# Altium project project_thermal.PrjPcb
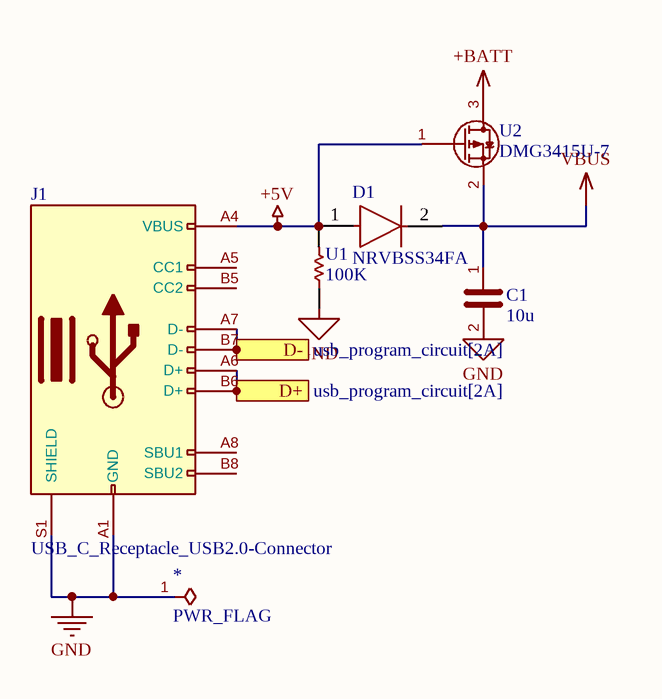
[diagram p0: USB_input_and_Power.SchDoc]
13 sheets, 58 parts. Net scope: flat (ports and power ports of the same name join across sheets).
Board file: Thermal_PCB.PcbDoc
Sheets:
  USB_input_and_Power.SchDoc
  3.3V_Regulator.SchDoc
  On_Off_switch.SchDoc
  batterij_charging.SchDoc
  batterij_voltage_sensor.SchDoc
  tft_display.SchDoc
  backlight_control.SchDoc
  usb_program_circuit.SchDoc
  esp32.SchDoc
  imagesensor.SchDoc
  ecternal_i2c.SchDoc
  navigatie_switches.SchDoc
  sd_card.SchDoc

## Sheet USB_input_and_Power.SchDoc
size A4; SheetNumber: 1; SheetTotal: 13

### Parts
(Parts that share a designator on the sheet are numbered #1, #2 ... from top to bottom, then left to right.)
*#1  PWR_FLAG  (graphical)
C1  10u  [CAPC2013X70X45NL10T25]
D1  NRVBSS34FA  [NRVBSS34FA]
J1  USB_C_Receptacle_USB2.0-Connector  [Type C USB Connector]
U1  100K  [RESC2013X70X40NL20T20]
U2  DMG3415U-7  [DMG3415U-7]

### Ports
D+ (see usb_program_circuit[2A]), D- (see usb_program_circuit[2A])

### Nets
+5V: D1.1 J1.A4(VBUS) U1.2 U2.1(G)
+BATT: U2.3(D)
GND: *#1.1(pwr) C1.2 J1.A1(GND) J1.S1(SHIELD) U1.1
VBUS: C1.1 D1.2 U2.2(S)
NetJ1_A6: J1.A6(D+) J1.B6(D+) ; port D+
NetJ1_A7: J1.A7(D-) J1.B7(D-) ; port D-

Not connected (* = marked no-connect by the designer): J1 A5(CC1) A8(SBU1) A9(VBUS) A12(GND) B1(GND) B4(VBUS) B5(CC2) B8(SBU2) B9(VBUS) B12(GND)

### Library data of the parts
C1 = C
D1 = CMP-00278-103808874-1: NRVBSS34FA Schottky Barrier Rectifier Diode 40V 3A 2-Pin SOD−123FL T/R; Manufacturer Lifecycle Status: ACTIVE; Max Junction Temperature (Tj): 125°C; Capacitance: 152pF; Peak Reverse Current: 500µA; Max Forward Surge Current (Ifsm): 80A; RoHS: Compliant; Forward Current: 3A; Height: 1.43mm; Max Operating Temperature: 125°C; Min Operating Temperature: -55°C; Lifecycle Status: Production; Max Repetitive Reverse Voltage (Vrrm): 40V; Reverse Voltage: 40V; NexarPartId: 103808874
U1 = CMP-2100-03671-1: Chip Resistor, 1 KOhm, +/- 1%, 125 mW, -55 to 155 degC, 0805 (2012 Metric), RoHS, Tape and Reel; Manufacturer: Yageo; Temperature Coefficient: 100ppm/degreesC; Voltage Rating (DC): 150V; Max Power Dissipation: 125mW; Resistance: 1KOhm; Number of Pins: 2; Number of Terminations: 2; Datasheet URL: http://www.yageo.com/NewPortal/yageodocoutput?fileName=/pdf/R-Chip/PYu-RC_Group_51_RoHS_L_5.pdf; Length: 0.079inch; Package Description: 2-Pin Surface Mounted Device, Body 2 x 1.25 mm; Depth: 1.25mm; Height: 0.024inch; Military Standard: Not; Case/Package: 0805; Package Reference: 0805; RoHSCompliant: true; Lead Free: LeadFree; Packaging: TapeandReel; Package Quantity: 1; Datasheet Version: Rev. 5, 10/2016; Tolerance: 1%; Min Operating Temperature: -55degC; Voltage Rating: 150V; Composition: ThickFilm; Case Code (Imperial): 0805; Power Rating: 125mW; Width: 0.049inch; Case Code (Metric): 2012; Manufacturer URL: http://www.yageo.com/; Max Operating Temperature: 155degC; REACH SVHC: Unknown; Termination: SMD/SMT

## Sheet 3.3V_Regulator.SchDoc
size A4; SheetNumber: 2; SheetTotal: 13
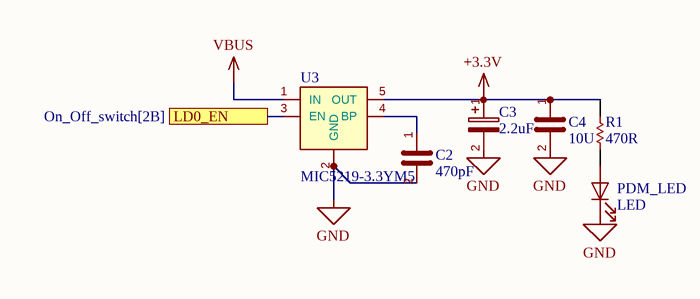
[diagram p1: 3.3V_Regulator.SchDoc]

### Parts
C2  470pF  [CAPC2013X70X45NL10T25]
C3  2.2uF  [Elco capacitor]
C4  10U  [CAPC2013X70X45NL10T25]
PDM_LED  LED  [LEDC2012X70N]
R1  470R  [RESC2013X70X40NL20T20]
U3  MIC5219-3.3YM5  [FP-SOT23-5LD-PL-1-MFG]

### Ports
LD0_EN (see On_Off_switch[2B])

### Nets
+3.3V: C3.1 C4.1 R1.1 U3.5(OUT)
GND: C2.2 C3.2 C4.2 PDM_LED.C U3.2(GND)
VBUS: U3.1(IN)
NetC2_1: C2.1 U3.4(BP)
NetPDM_LED_A: PDM_LED.A R1.2
NetSW_1_2: U3.3(EN) ; port LD0_EN

### Library data of the parts
C2 C4 = C
C3 = C_Polarized
R1 = CMP-2100-03671-1: as U1 on sheet USB_input_and_Power; Number of Pins: 2; Number of Terminations: 2; Datasheet URL: http://www.yageo.com/NewPortal/yageodocoutput?fileName=/pdf/R-Chip/PYu-RC_Group_51_RoHS_L_5.pdf; Length: 0.079inch; Package Description: 2-Pin Surface Mounted Device, Body 2 x 1.25 mm; Depth: 1.25mm; Height: 0.024inch; Military Standard: Not; Case/Package: 0805; Package Reference: 0805; RoHSCompliant: true; Lead Free: LeadFree; Packaging: TapeandReel; Package Quantity: 1; Datasheet Version: Rev. 5, 10/2016; Tolerance: 1%; Min Operating Temperature: -55degC; Voltage Rating: 150V; Composition: ThickFilm; Case Code (Imperial): 0805; Power Rating: 125mW; Width: 0.049inch; Case Code (Metric): 2012; Manufacturer URL: http://www.yageo.com/; Max Operating Temperature: 155degC; REACH SVHC: Unknown; Termination: SMD/SMT

## Sheet On_Off_switch.SchDoc
size A4; SheetNumber: 3; SheetTotal: 13
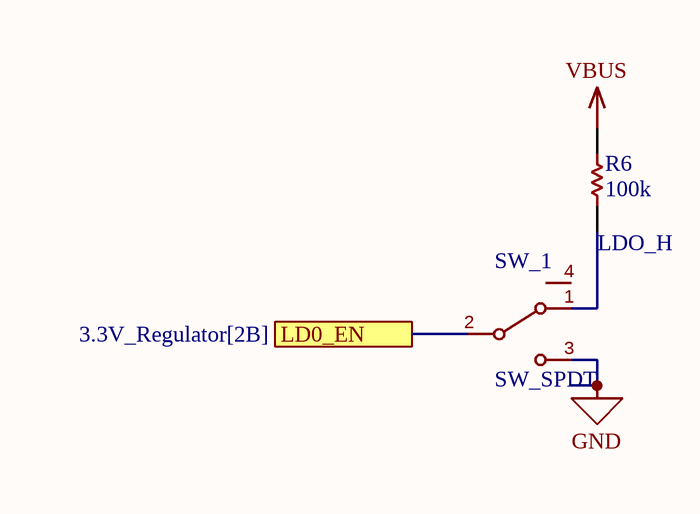
[diagram p2: On_Off_switch.SchDoc]

### Parts
R6  100k  [RESC2013X70X40NL20T20]
SW_1  SW_SPDT  [SW_MPB06-1C00-R-SMT-TR]

### Ports
LD0_EN (see 3.3V_Regulator[2B])

### Nets
GND: SW_1.3(C)
VBUS: R6.2
NetR6_1: R6.1 SW_1.1(A)
NetSW_1_2: SW_1.2(B) ; port LD0_EN

Not connected (* = marked no-connect by the designer): SW_1 4

### Notes on the sheet
- (near R6) LDO_H

### Library data of the parts
R6 = CMP-2100-03671-1: as U1 on sheet USB_input_and_Power; Number of Pins: 2; Number of Terminations: 2; Datasheet URL: http://www.yageo.com/NewPortal/yageodocoutput?fileName=/pdf/R-Chip/PYu-RC_Group_51_RoHS_L_5.pdf; Length: 0.079inch; Package Description: 2-Pin Surface Mounted Device, Body 2 x 1.25 mm; Depth: 1.25mm; Height: 0.024inch; Military Standard: Not; Case/Package: 0805; Package Reference: 0805; RoHSCompliant: true; Lead Free: LeadFree; Packaging: TapeandReel; Package Quantity: 1; Datasheet Version: Rev. 5, 10/2016; Tolerance: 1%; Min Operating Temperature: -55degC; Voltage Rating: 150V; Composition: ThickFilm; Case Code (Imperial): 0805; Power Rating: 125mW; Width: 0.049inch; Case Code (Metric): 2012; Manufacturer URL: http://www.yageo.com/; Max Operating Temperature: 155degC; REACH SVHC: Unknown; Termination: SMD/SMT

## Sheet batterij_charging.SchDoc
size A4; SheetNumber: 4; SheetTotal: 13
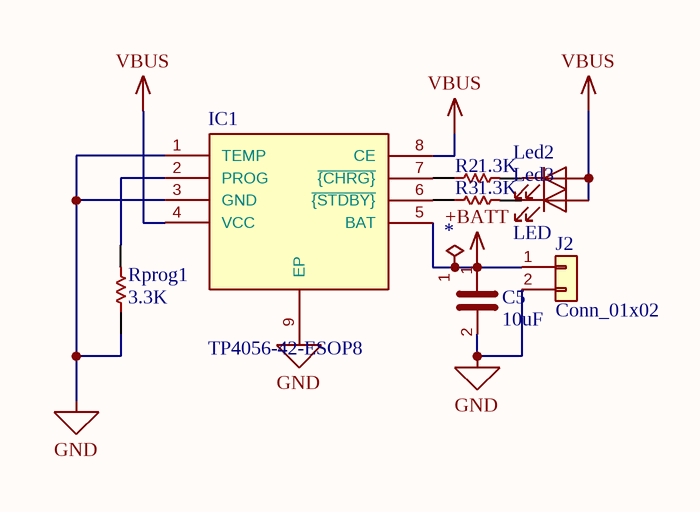
[diagram p3: batterij_charging.SchDoc]

### Parts
(Parts that share a designator on the sheet are numbered #1, #2 ... from top to bottom, then left to right.)
*#2  PWR_FLAG  (value not drawn)  (graphical)
C5  10uF  [CAPC2013X70X45NL10T25]
IC1  TP4056-42-ESOP8  [tp4056]
J2  Conn_01x02  [connector 2pin]
Led2  LED  [LEDC2012X70N]  (value not drawn)
Led3  LED  [LEDC2012X70N]
R2  1.3K  [RESC2013X70X40NL20T20]
R3  1.3K  [RESC2013X70X40NL20T20]
Rprog1  3.3K  [RESC2013X70X40NL20T20]

### Nets
+BATT: *#2.1(pwr) C5.1 IC1.5(BAT) J2.1(Pin_1)
GND: C5.2 IC1.1(TEMP) IC1.3(GND) IC1.9(EP) J2.2(Pin_2) Rprog1.1
VBUS: IC1.4(VCC) IC1.8(CE) Led2.A Led3.A
NetIC1_2: IC1.2(PROG) Rprog1.2
NetIC1_6: IC1.6(~{{STDBY}}) R3.1
NetIC1_7: IC1.7(~{{CHRG}}) R2.1
NetLed2_C: Led2.C R2.2
NetLed3_C: Led3.C R3.2

### Library data of the parts
C5 = C
R2 R3 Rprog1 = CMP-2100-03671-1: as U1 on sheet USB_input_and_Power; Number of Pins: 2; Number of Terminations: 2; Datasheet URL: http://www.yageo.com/NewPortal/yageodocoutput?fileName=/pdf/R-Chip/PYu-RC_Group_51_RoHS_L_5.pdf; Length: 0.079inch; Package Description: 2-Pin Surface Mounted Device, Body 2 x 1.25 mm; Depth: 1.25mm; Height: 0.024inch; Military Standard: Not; Case/Package: 0805; Package Reference: 0805; RoHSCompliant: true; Lead Free: LeadFree; Packaging: TapeandReel; Package Quantity: 1; Datasheet Version: Rev. 5, 10/2016; Tolerance: 1%; Min Operating Temperature: -55degC; Voltage Rating: 150V; Composition: ThickFilm; Case Code (Imperial): 0805; Power Rating: 125mW; Width: 0.049inch; Case Code (Metric): 2012; Manufacturer URL: http://www.yageo.com/; Max Operating Temperature: 155degC; REACH SVHC: Unknown; Termination: SMD/SMT

## Sheet batterij_voltage_sensor.SchDoc
size A4; SheetNumber: 5; SheetTotal: 13
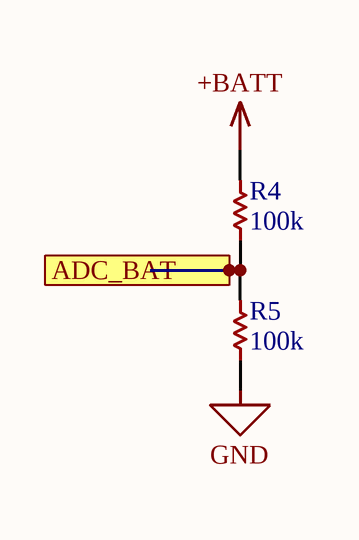
[diagram p4: batterij_voltage_sensor.SchDoc]

### Parts
R4  100k  [RESC2013X70X40NL20T20]
R5  100k  [RESC2013X70X40NL20T20]

### Ports
ADC_BAT

### Nets
+BATT: R4.2
GND: R5.1
NetR4_1: R4.1 R5.2 ; port ADC_BAT

### Library data of the parts
R4 R5 = CMP-2100-03671-1: as U1 on sheet USB_input_and_Power; Number of Pins: 2; Number of Terminations: 2; Datasheet URL: http://www.yageo.com/NewPortal/yageodocoutput?fileName=/pdf/R-Chip/PYu-RC_Group_51_RoHS_L_5.pdf; Length: 0.079inch; Package Description: 2-Pin Surface Mounted Device, Body 2 x 1.25 mm; Depth: 1.25mm; Height: 0.024inch; Military Standard: Not; Case/Package: 0805; Package Reference: 0805; RoHSCompliant: true; Lead Free: LeadFree; Packaging: TapeandReel; Package Quantity: 1; Datasheet Version: Rev. 5, 10/2016; Tolerance: 1%; Min Operating Temperature: -55degC; Voltage Rating: 150V; Composition: ThickFilm; Case Code (Imperial): 0805; Power Rating: 125mW; Width: 0.049inch; Case Code (Metric): 2012; Manufacturer URL: http://www.yageo.com/; Max Operating Temperature: 155degC; REACH SVHC: Unknown; Termination: SMD/SMT

## Sheet tft_display.SchDoc
size A4; SheetNumber: 6; SheetTotal: 13
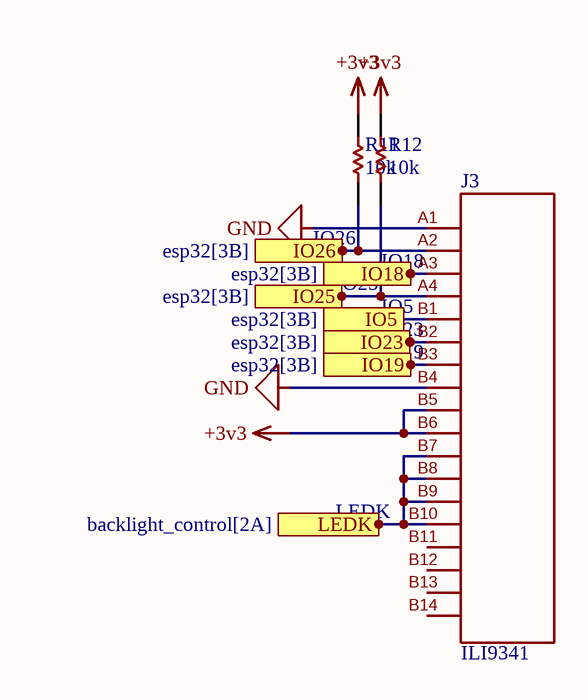
[diagram p5: tft_display.SchDoc]

### Parts
J3  ILI9341  [ILI9341]
R11  10k  [RESC2013X70X40NL20T20]
R12  10k  [RESC2013X70X40NL20T20]

### Ports
IO5 (see esp32[3B]), IO18 (see esp32[3B]), IO19 (see esp32[3B]), IO23 (see esp32[3B]), IO25 (see esp32[3B]), IO26 (see esp32[3B]), LEDK (see backlight_control[2A])

### Nets
+3v3: J3.B5(VDD) J3.B6(LEDA) R11.2 R12.2
GND: J3.A1(GND) J3.B4(GND)
NetJ3_A2: J3.A2(RESET) R11.1 ; port IO26
NetJ3_A3: J3.A3(SCL) ; port IO18
NetJ3_A4: J3.A4(RS) R12.1 ; port IO25
NetJ3_B1: J3.B1(CS) ; port IO5
NetJ3_B2: J3.B2(SDA) ; port IO23
NetJ3_B3: J3.B3(SDO) ; port IO19
NetJ3_B7: J3.B7(LEDK1) J3.B8(LEDK2) J3.B9(LEDK3) J3.B10(LEDK4) ; port LEDK

Not connected (* = marked no-connect by the designer): J3 B11(XL) B12(YU) B13(XR) B14(YD)

### Notes on the sheet
- IO26
- IO25
- (near J3) IO18
- (near J3) IO5
- (near J3) IO23
- (near J3) IO19
- (near J3) LEDK

### Library data of the parts
R11 R12 = CMP-2100-03671-1: as U1 on sheet USB_input_and_Power; Number of Pins: 2; Number of Terminations: 2; Datasheet URL: http://www.yageo.com/NewPortal/yageodocoutput?fileName=/pdf/R-Chip/PYu-RC_Group_51_RoHS_L_5.pdf; Length: 0.079inch; Package Description: 2-Pin Surface Mounted Device, Body 2 x 1.25 mm; Depth: 1.25mm; Height: 0.024inch; Military Standard: Not; Case/Package: 0805; Package Reference: 0805; RoHSCompliant: true; Lead Free: LeadFree; Packaging: TapeandReel; Package Quantity: 1; Datasheet Version: Rev. 5, 10/2016; Tolerance: 1%; Min Operating Temperature: -55degC; Voltage Rating: 150V; Composition: ThickFilm; Case Code (Imperial): 0805; Power Rating: 125mW; Width: 0.049inch; Case Code (Metric): 2012; Manufacturer URL: http://www.yageo.com/; Max Operating Temperature: 155degC; REACH SVHC: Unknown; Termination: SMD/SMT

## Sheet backlight_control.SchDoc
size A4; SheetNumber: 7; SheetTotal: 13
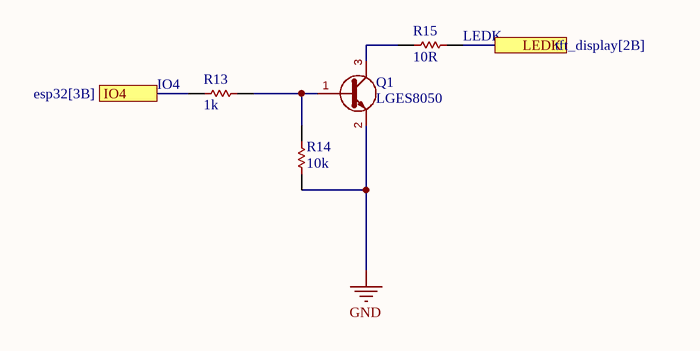
[diagram p6: backlight_control.SchDoc]

### Parts
Q1  LGES8050  [FP-SS8050-G-IPC_A]
R13  1k  [RESC2013X70X40NL20T20]
R14  10k  [RESC2013X70X40NL20T20]
R15  10R  [RESC2013X70X40NL20T20]

### Ports
IO4 (see esp32[3B]), LEDK (see tft_display[2B])

### Nets
GND: Q1.2(B) R14.1
NetJ3_B7: R15.1 ; port LEDK
NetQ1_1: Q1.1(E) R13.1 R14.2
NetQ1_3: Q1.3(C) R15.2
NetR13_2: R13.2 ; port IO4

### Notes on the sheet
- (near R15) LEDK
- (near R13) IO4

### Library data of the parts
R13-R15 = CMP-2100-03671-1: as U1 on sheet USB_input_and_Power; Number of Pins: 2; Number of Terminations: 2; Datasheet URL: http://www.yageo.com/NewPortal/yageodocoutput?fileName=/pdf/R-Chip/PYu-RC_Group_51_RoHS_L_5.pdf; Length: 0.079inch; Package Description: 2-Pin Surface Mounted Device, Body 2 x 1.25 mm; Depth: 1.25mm; Height: 0.024inch; Military Standard: Not; Case/Package: 0805; Package Reference: 0805; RoHSCompliant: true; Lead Free: LeadFree; Packaging: TapeandReel; Package Quantity: 1; Datasheet Version: Rev. 5, 10/2016; Tolerance: 1%; Min Operating Temperature: -55degC; Voltage Rating: 150V; Composition: ThickFilm; Case Code (Imperial): 0805; Power Rating: 125mW; Width: 0.049inch; Case Code (Metric): 2012; Manufacturer URL: http://www.yageo.com/; Max Operating Temperature: 155degC; REACH SVHC: Unknown; Termination: SMD/SMT

## Sheet usb_program_circuit.SchDoc
size A4; SheetNumber: 8; SheetTotal: 13
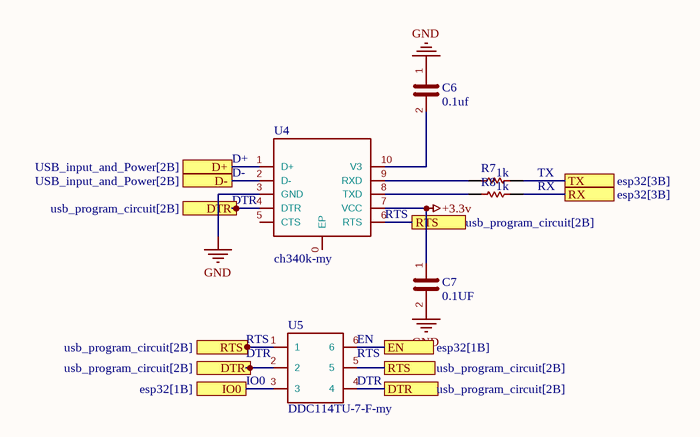
[diagram p7: usb_program_circuit.SchDoc]

### Parts
C6  0.1uf  [CAPC2013X70X45NL10T25]
C7  0.1UF  [CAPC2013X70X45NL10T25]
R7  1k  [RESC2013X70X40NL20T20]
R8  1k  [RESC2013X70X40NL20T20]
U4  ch340k-my  [SOP100P600X160-11N]
U5  DDC114TU-7-F-my  [DDC114TU-7-F]

### Ports
D+ (see USB_input_and_Power[2B]), D- (see USB_input_and_Power[2B]), DTR (see usb_program_circuit[2B]), EN (see esp32[1B]), IO0 (see esp32[1B]), RTS (see usb_program_circuit[2B]), RX (see esp32[3B]), TX (see esp32[3B])

### Nets
+3.3V: C7.1 U4.7(VCC)
GND: C6.1 C7.2 U4.3(GND)
NetC6_2: C6.2 U4.10(V3)
NetJ1_A6: U4.1(D+) ; port D+
NetJ1_A7: U4.2(D-) ; port D-
NetR7_1: R7.1 ; port TX
NetR7_2: R7.2 U4.9(RXD)
NetR8_1: R8.1 ; port RX
NetR8_2: R8.2 U4.8(TXD)
NetSW_2_1: U5.3 ; port IO0
NetSW_3_1: U5.6 ; port EN
NetU4_4: U4.4(DTR) U5.2 U5.4 ; port DTR
NetU4_6: U4.6(RTS) U5.1 U5.5 ; port RTS

Not connected (* = marked no-connect by the designer): U4 0(EP) 5(CTS)

### Notes on the sheet
- (near U4) D+
- (near U4) D-
- TX
- RX
- (near U4) DTR
- (near U4) RTS
- (near U5) RTS
- (near U5) DTR
- (near U5) IO0
- (near U5) EN

### Library data of the parts
C6 C7 = C
R7 R8 = CMP-2100-03671-1: as U1 on sheet USB_input_and_Power; Number of Pins: 2; Number of Terminations: 2; Datasheet URL: http://www.yageo.com/NewPortal/yageodocoutput?fileName=/pdf/R-Chip/PYu-RC_Group_51_RoHS_L_5.pdf; Length: 0.079inch; Package Description: 2-Pin Surface Mounted Device, Body 2 x 1.25 mm; Depth: 1.25mm; Height: 0.024inch; Military Standard: Not; Case/Package: 0805; Package Reference: 0805; RoHSCompliant: true; Lead Free: LeadFree; Packaging: TapeandReel; Package Quantity: 1; Datasheet Version: Rev. 5, 10/2016; Tolerance: 1%; Min Operating Temperature: -55degC; Voltage Rating: 150V; Composition: ThickFilm; Case Code (Imperial): 0805; Power Rating: 125mW; Width: 0.049inch; Case Code (Metric): 2012; Manufacturer URL: http://www.yageo.com/; Max Operating Temperature: 155degC; REACH SVHC: Unknown; Termination: SMD/SMT

## Sheet esp32.SchDoc
size A4; SheetNumber: 9; SheetTotal: 13
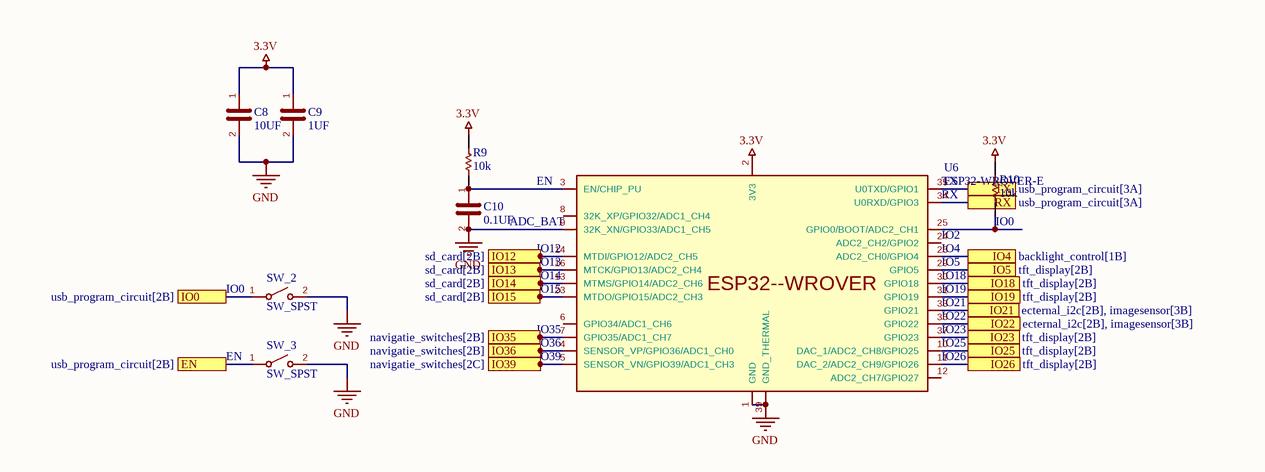
[diagram p8: esp32.SchDoc]

### Parts
C8  10UF  [CAPC2013X70X45NL10T25]
C9  1UF  [CAPC2013X70X45NL10T25]
C10  0.1UF  [CAPC2013X70X45NL10T25]
R9  10k  [RESC2013X70X40NL20T20]
R10  10k  [RESC2013X70X40NL20T20]
SW_2  SW_SPST  [SW_TS09-63-25-WT-160-SMT-TR]
SW_3  SW_SPST  [SW_TS09-63-25-WT-160-SMT-TR]
U6  ESP32-WROVER-E  [FP-ESP32-WROVER-I-MFG]

### Ports
EN (see usb_program_circuit[2B]), IO0 (see usb_program_circuit[2B]), IO4 (see backlight_control[1B]), IO5 (see tft_display[2B]), IO12 (see sd_card[2B]), IO13 (see sd_card[2B]), IO14 (see sd_card[2B]), IO15 (see sd_card[2B]), IO18 (see tft_display[2B]), IO19 (see tft_display[2B]), IO21 (see ecternal_i2c[2B], imagesensor[3B]), IO22 (see ecternal_i2c[2B], imagesensor[3B]), IO23 (see tft_display[2B]), IO25 (see tft_display[2B]), IO26 (see tft_display[2B]), IO35 (see navigatie_switches[2B]), IO36 (see navigatie_switches[2B]), IO39 (see navigatie_switches[2C]), RX (see usb_program_circuit[3A]), TX (see usb_program_circuit[3A])

### Nets
3.3V: C8.1 C9.1 R9.2 R10.2 U6.2(3V3)
GND: C8.2 C9.2 C10.2 SW_2.2(B) SW_3.2(B) U6.1(GND) U6.9(32K_XN/GPIO33/ADC1_CH5) U6.39(GND_THERMAL)
NetC10_1: C10.1 R9.1 U6.3(EN/CHIP_PU)
NetJ3_A2: U6.11(DAC_2/ADC2_CH9/GPIO26) ; port IO26
NetJ3_A3: U6.30(GPIO18) ; port IO18
NetJ3_A4: U6.10(DAC_1/ADC2_CH8/GPIO25) ; port IO25
NetJ3_B1: U6.29(GPIO5) ; port IO5
NetJ3_B2: U6.37(GPIO23) ; port IO23
NetJ3_B3: U6.31(GPIO19) ; port IO19
NetJ4_1: U6.33(GPIO21) ; port IO21
NetJ4_2: U6.36(GPIO22) ; port IO22
NetR7_1: U6.35(U0TXD/GPIO1) ; port TX
NetR8_1: U6.34(U0RXD/GPIO3) ; port RX
NetR10_1: R10.1 U6.25(GPIO0/BOOT/ADC2_CH1)
NetR13_2: U6.26(ADC2_CH0/GPIO4) ; port IO4
NetR16_1: U6.5(SENSOR_VN/GPIO39/ADC1_CH3) ; port IO39
NetR17_1: U6.4(SENSOR_VP/GPIO36/ADC1_CH0) ; port IO36
NetR18_1: U6.7(GPIO35/ADC1_CH7) ; port IO35
NetSD1_2: U6.23(MTDO/GPIO15/ADC2_CH3) ; port IO15
NetSD1_3: U6.16(MTCK/GPIO13/ADC2_CH4) ; port IO13
NetSD1_5: U6.13(MTMS/GPIO14/ADC2_CH6) ; port IO14
NetSD1_7: U6.14(MTDI/GPIO12/ADC2_CH5) ; port IO12
NetSW_2_1: SW_2.1(A) ; port IO0
NetSW_3_1: SW_3.1(A) ; port EN

Not connected (* = marked no-connect by the designer): U6 6(GPIO34/ADC1_CH6) 8(32K_XP/GPIO32/ADC1_CH4) 12(ADC2_CH7/GPIO27) 15(GND) 24(ADC2_CH2/GPIO2) 38(GND)

### Notes on the sheet
- ADC_BAT
- (near U6) EN
- (near U6) TX
- (near U6) RX
- (near U6) IO2
- (near R10) IO0
- (near SW_2) IO0
- (near U6) IO12
- (near U6) IO13
- (near U6) IO14
- (near U6) IO15
- (near U6) IO4
- (near U6) IO5
- (near U6) IO18
- (near U6) IO19
- (near U6) IO21
- (near SW_3) EN
- (near U6) IO35
- (near U6) IO36
- (near U6) IO39
- (near U6) IO22
- (near U6) IO23
- (near U6) IO25
- (near U6) IO26
- (in symbol ESP32-WROVER-E) ESP32-­WROVER

### Library data of the parts
C8-C10 = C
R9 R10 = CMP-2100-03671-1: as U1 on sheet USB_input_and_Power; Number of Pins: 2; Number of Terminations: 2; Datasheet URL: http://www.yageo.com/NewPortal/yageodocoutput?fileName=/pdf/R-Chip/PYu-RC_Group_51_RoHS_L_5.pdf; Length: 0.079inch; Package Description: 2-Pin Surface Mounted Device, Body 2 x 1.25 mm; Depth: 1.25mm; Height: 0.024inch; Military Standard: Not; Case/Package: 0805; Package Reference: 0805; RoHSCompliant: true; Lead Free: LeadFree; Packaging: TapeandReel; Package Quantity: 1; Datasheet Version: Rev. 5, 10/2016; Tolerance: 1%; Min Operating Temperature: -55degC; Voltage Rating: 150V; Composition: ThickFilm; Case Code (Imperial): 0805; Power Rating: 125mW; Width: 0.049inch; Case Code (Metric): 2012; Manufacturer URL: http://www.yageo.com/; Max Operating Temperature: 155degC; REACH SVHC: Unknown; Termination: SMD/SMT

## Sheet imagesensor.SchDoc
size A4; SheetNumber: 10; SheetTotal: 13
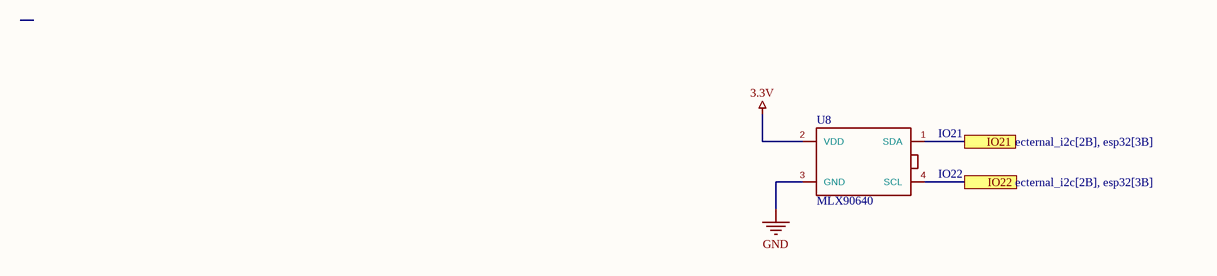
[diagram p9: imagesensor.SchDoc]

### Parts
U8  MLX90640  [FP-MLX90640ESF-BAA-000-TU-MFG]

### Ports
IO21 (see ecternal_i2c[2B], esp32[3B]), IO22 (see ecternal_i2c[2B], esp32[3B])

### Nets
3.3V: U8.2(VDD)
GND: U8.3(GND)
NetJ4_1: U8.1(SDA) ; port IO21
NetJ4_2: U8.4(SCL) ; port IO22

### Notes on the sheet
- (near U8) IO21
- (near U8) IO22

## Sheet ecternal_i2c.SchDoc
size A4; SheetNumber: 11; SheetTotal: 13
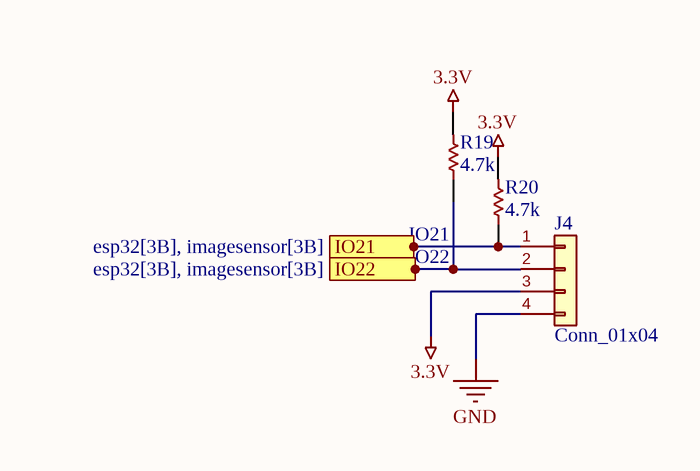
[diagram p10: ecternal_i2c.SchDoc]

### Parts
J4  Conn_01x04  [connector 4pin]
R19  4.7k  [RESC2013X70X40NL20T20]
R20  4.7k  [RESC2013X70X40NL20T20]

### Ports
IO21 (see esp32[3B], imagesensor[3B]), IO22 (see esp32[3B], imagesensor[3B])

### Nets
3.3V: J4.3(Pin_3) R19.2 R20.2
GND: J4.4(Pin_4)
NetJ4_1: J4.1(Pin_1) R20.1 ; port IO21
NetJ4_2: J4.2(Pin_2) R19.1 ; port IO22

### Notes on the sheet
- IO21
- IO22

### Library data of the parts
R19 R20 = CMP-2100-03671-1: as U1 on sheet USB_input_and_Power; Number of Pins: 2; Number of Terminations: 2; Datasheet URL: http://www.yageo.com/NewPortal/yageodocoutput?fileName=/pdf/R-Chip/PYu-RC_Group_51_RoHS_L_5.pdf; Length: 0.079inch; Package Description: 2-Pin Surface Mounted Device, Body 2 x 1.25 mm; Depth: 1.25mm; Height: 0.024inch; Military Standard: Not; Case/Package: 0805; Package Reference: 0805; RoHSCompliant: true; Lead Free: LeadFree; Packaging: TapeandReel; Package Quantity: 1; Datasheet Version: Rev. 5, 10/2016; Tolerance: 1%; Min Operating Temperature: -55degC; Voltage Rating: 150V; Composition: ThickFilm; Case Code (Imperial): 0805; Power Rating: 125mW; Width: 0.049inch; Case Code (Metric): 2012; Manufacturer URL: http://www.yageo.com/; Max Operating Temperature: 155degC; REACH SVHC: Unknown; Termination: SMD/SMT

## Sheet navigatie_switches.SchDoc
size A4; SheetNumber: 12; SheetTotal: 13
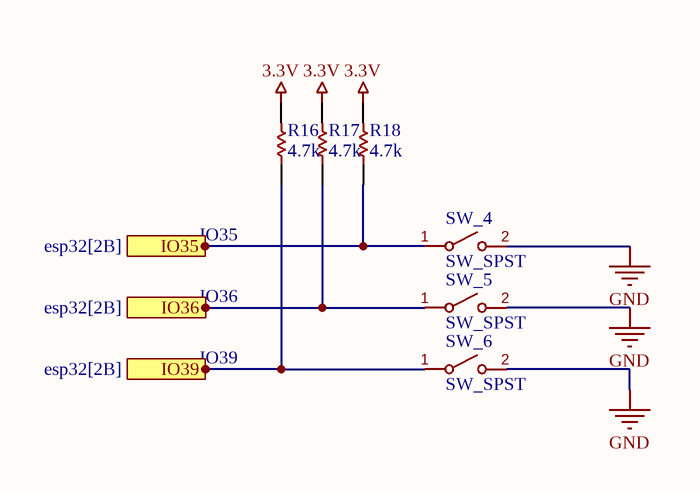
[diagram p11: navigatie_switches.SchDoc]

### Parts
R16  4.7k  [RESC2013X70X40NL20T20]
R17  4.7k  [RESC2013X70X40NL20T20]
R18  4.7k  [RESC2013X70X40NL20T20]
SW_4  SW_SPST  [SW_TS09-63-25-WT-160-SMT-TR]
SW_5  SW_SPST  [SW_TS09-63-25-WT-160-SMT-TR]
SW_6  SW_SPST  [SW_TS09-63-25-WT-160-SMT-TR]

### Ports
IO35 (see esp32[2B]), IO36 (see esp32[2B]), IO39 (see esp32[2B])

### Nets
3.3V: R16.2 R17.2 R18.2
GND: SW_4.2(B) SW_5.2(B) SW_6.2(B)
NetR16_1: R16.1 SW_6.1(A) ; port IO39
NetR17_1: R17.1 SW_5.1(A) ; port IO36
NetR18_1: R18.1 SW_4.1(A) ; port IO35

### Notes on the sheet
- IO35
- IO36
- IO39

### Library data of the parts
R16-R18 = CMP-2100-03671-1: as U1 on sheet USB_input_and_Power; Number of Pins: 2; Number of Terminations: 2; Datasheet URL: http://www.yageo.com/NewPortal/yageodocoutput?fileName=/pdf/R-Chip/PYu-RC_Group_51_RoHS_L_5.pdf; Length: 0.079inch; Package Description: 2-Pin Surface Mounted Device, Body 2 x 1.25 mm; Depth: 1.25mm; Height: 0.024inch; Military Standard: Not; Case/Package: 0805; Package Reference: 0805; RoHSCompliant: true; Lead Free: LeadFree; Packaging: TapeandReel; Package Quantity: 1; Datasheet Version: Rev. 5, 10/2016; Tolerance: 1%; Min Operating Temperature: -55degC; Voltage Rating: 150V; Composition: ThickFilm; Case Code (Imperial): 0805; Power Rating: 125mW; Width: 0.049inch; Case Code (Metric): 2012; Manufacturer URL: http://www.yageo.com/; Max Operating Temperature: 155degC; REACH SVHC: Unknown; Termination: SMD/SMT

## Sheet sd_card.SchDoc
size A4; SheetNumber: 13; SheetTotal: 13
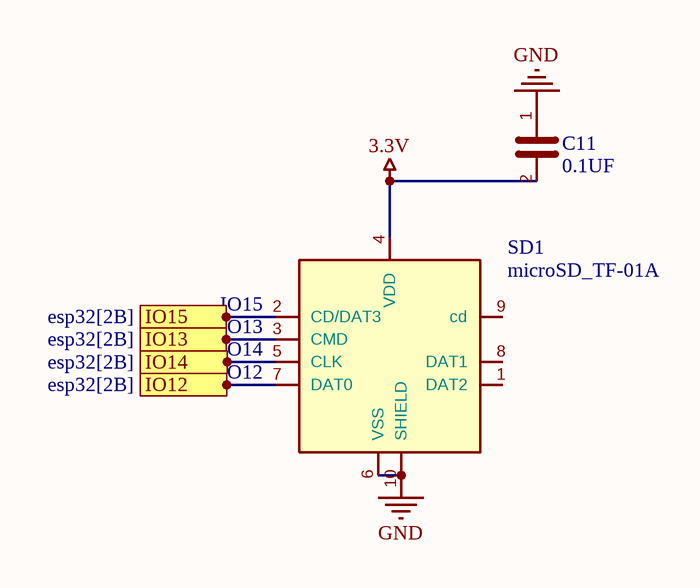
[diagram p12: sd_card.SchDoc]

### Parts
C11  0.1UF  [CAPC2013X70X45NL10T25]
SD1  microSD_TF-01A  [TF-01A]

### Ports
IO12 (see esp32[2B]), IO13 (see esp32[2B]), IO14 (see esp32[2B]), IO15 (see esp32[2B])

### Nets
3.3V: C11.2 SD1.4(VDD)
GND: C11.1 SD1.6(VSS) SD1.10(SHIELD)
NetSD1_2: SD1.2(CD/DAT3) ; port IO15
NetSD1_3: SD1.3(CMD) ; port IO13
NetSD1_5: SD1.5(CLK) ; port IO14
NetSD1_7: SD1.7(DAT0) ; port IO12

Not connected (* = marked no-connect by the designer): SD1 1(DAT2) 8(DAT1) 9(cd)

### Notes on the sheet
- (near SD1) IO15
- (near SD1) IO13
- (near SD1) IO14
- (near SD1) IO12

### Library data of the parts
C11 = C

## Nets that join several sheets
3.3V: esp32 (5 pins), imagesensor (U8.2), ecternal_i2c (J4.3 R19.2 R20.2), navigatie_switches (R16.2 R17.2 R18.2), sd_card (C11.2 SD1.4)
+3.3V: 3.3V_Regulator (C3.1 C4.1 R1.1 U3.5), usb_program_circuit (C7.1 U4.7)
+BATT: USB_input_and_Power (U2.3), batterij_charging (*#2.1 C5.1 IC1.5 J2.1), batterij_voltage_sensor (R4.2)
GND: USB_input_and_Power (5 pins), 3.3V_Regulator (5 pins), On_Off_switch (SW_1.3), batterij_charging (6 pins), batterij_voltage_sensor (R5.1), tft_display (J3.A1 J3.B4), backlight_control (Q1.2 R14.1), usb_program_circuit (C6.1 C7.2 U4.3), esp32 (8 pins), imagesensor (U8.3), ecternal_i2c (J4.4), navigatie_switches (SW_4.2 SW_5.2 SW_6.2), sd_card (C11.1 SD1.6 SD1.10)
VBUS: USB_input_and_Power (C1.1 D1.2 U2.2), 3.3V_Regulator (U3.1), On_Off_switch (R6.2), batterij_charging (IC1.4 IC1.8 Led2.A Led3.A)
NetJ1_A6: USB_input_and_Power (J1.A6 J1.B6), usb_program_circuit (U4.1)
NetJ1_A7: USB_input_and_Power (J1.A7 J1.B7), usb_program_circuit (U4.2)
NetJ3_A2: tft_display (J3.A2 R11.1), esp32 (U6.11)
NetJ3_A3: tft_display (J3.A3), esp32 (U6.30)
NetJ3_A4: tft_display (J3.A4 R12.1), esp32 (U6.10)
NetJ3_B1: tft_display (J3.B1), esp32 (U6.29)
NetJ3_B2: tft_display (J3.B2), esp32 (U6.37)
NetJ3_B3: tft_display (J3.B3), esp32 (U6.31)
NetJ3_B7: tft_display (J3.B7 J3.B8 J3.B9 J3.B10), backlight_control (R15.1)
NetJ4_1: esp32 (U6.33), imagesensor (U8.1), ecternal_i2c (J4.1 R20.1)
NetJ4_2: esp32 (U6.36), imagesensor (U8.4), ecternal_i2c (J4.2 R19.1)
NetR7_1: usb_program_circuit (R7.1), esp32 (U6.35)
NetR8_1: usb_program_circuit (R8.1), esp32 (U6.34)
NetR13_2: backlight_control (R13.2), esp32 (U6.26)
NetR16_1: esp32 (U6.5), navigatie_switches (R16.1 SW_6.1)
NetR17_1: esp32 (U6.4), navigatie_switches (R17.1 SW_5.1)
NetR18_1: esp32 (U6.7), navigatie_switches (R18.1 SW_4.1)
NetSD1_2: esp32 (U6.23), sd_card (SD1.2)
NetSD1_3: esp32 (U6.16), sd_card (SD1.3)
NetSD1_5: esp32 (U6.13), sd_card (SD1.5)
NetSD1_7: esp32 (U6.14), sd_card (SD1.7)
NetSW_1_2: 3.3V_Regulator (U3.3), On_Off_switch (SW_1.2)
NetSW_2_1: usb_program_circuit (U5.3), esp32 (SW_2.1)
NetSW_3_1: usb_program_circuit (U5.6), esp32 (SW_3.1)